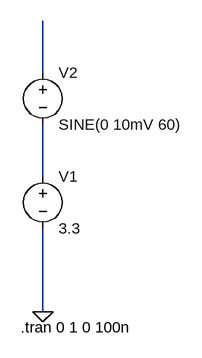
[diagram p0: schematic amp01b.asc]
amp01b.asc, the LTspice schematic file:
Version 4
SHEET 1 880 680
WIRE 224 32 224 -48
WIRE 224 192 224 112
WIRE 224 400 224 272
FLAG 224 400 0
SYMBOL voltage 224 176 R0
WINDOW 123 0 0 Left 2
WINDOW 39 0 0 Left 2
SYMATTR InstName V1
SYMATTR Value 3.3
SYMBOL voltage 224 16 R0
WINDOW 123 0 0 Left 2
WINDOW 39 0 0 Left 2
SYMATTR InstName V2
SYMATTR Value SINE(0 10mV 60)
TEXT 190 424 Left 2 !.tran 0 1 0 100n

The netlist it stands for:
* amp01b.asc
V1 N002 0 3.3
V2 N001 N002 SINE(0 10mV 60)
.tran 0 1 0 100n
.backanno
.end